# Altium schematic sheet List2.SchDoc
size 209 x 297 mm; SheetNumber: 1; SheetTotal: 1; Scale: 1:1; PageSetup: Record=PageOptions|CenterHorizontal=False|CenterVertical=False|PrintScale=0.95|XCorrection=0.00|YCorrection=0.00|PrintKind=1|BorderSize=5000000|LeftOffset=0|BottomOffset=0|Orientation=1|PaperLength=1000|PaperWidth=1000|Scale=100|PaperSource=15|PrintQuality=600|MediaType=1|DitherType=10|PaperKind=A4|PrintScaleMode=1; Rule: PcbType=ProtelPcb
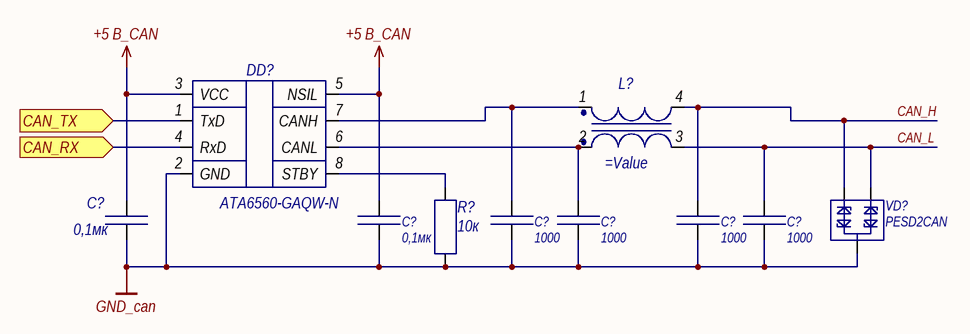
[diagram p0: List2.SchDoc]

## Parts
(Parts that share a designator on the sheet are numbered #1, #2 ... from top to bottom, then left to right.)
C?#1  0,1мк  [CAPC1608N_SL]
C?#2  0,1мк  [CAPC1608N_SL]
C?#3  1000  [CAPC1608N_SL]
C?#4  1000  [CAPC1608N_SL]
C?#5  1000  [CAPC1608N_SL]
C?#6  1000  [CAPC1608N_SL]
DD?  ATA6560-GAQW-N  [SOIC-8N]
L?  (no value)  [DR331]
R?  10к  [RESC1608N_SL]
VD?  PESD2CAN  [SOT23-3N]

## Ports
CAN_RX (in), CAN_TX (in)

## Nets
+5 В_CAN: C?#1.1 C?#2.1 DD?.3(VCC) DD?.5(NSIL)
GND_can: C?#1.2 C?#2.2 C?#3.2 C?#4.2 C?#5.2 C?#6.2 DD?.2(GND) R?.1 VD?.3
CAN_H: C?#5.1 L?.4 VD?.2
CAN_L: C?#6.1 L?.3 VD?.1
CAN_RX: DD?.4(RxD) ; port CAN_RX
CAN_TX: DD?.1(TxD) ; port CAN_TX
NetC?#3_1: C?#3.1 DD?.7(CANH) L?.1
NetC?#4_1: C?#4.1 DD?.6(CANL) L?.2
NetDD?_8: DD?.8(STBY) R?.2

## Notes on the sheet
- Подп. и дата
- Инв. № дубл.
- Взам. инв. №
- Инв. № подл.
- Лист
- Изм.
- № докум.
- Подп.
- Дата
- Копировал
- Фотмат А4

## Library data of the parts
C?#1 = CC0603KRX7R0BB104_Yageo: 0.1µF ±10% 100V Ceramic Capacitor X7R 0603 (1608 Metric); Manufacturer: Yageo; Voltage: 100 В; ValueBOM: Конденсатор CC0603KRX7R0BB104 "Yageo" (0,1 мкФ ± 10 %, 100 В, X7R, SMD 0603); Sorting: 100000; Автор: Ткаченко М.; Количество1: 1; Цена1: 0,21; Количество2: 10; Цена2: 0,14; Разрешен к применению: True; PartNumber: CC0603KRX7R0BB104_Yageo; ManufacturerPartNumber: CC0603KRX7R0BB104; ComponentLink3URL: http://www.yageo.com/documents/recent/UPY-NP0X7R_MV_100-to-630V_18.pdf; ComponentLink3Description: Datasheet; Value: 0,1мк; Tolerance: ± 10 %; TKE: X7R; ComponentLink2Description: Manufacturer Link; ComponentLink2URL: http://www.yageo.com/; Operating Temperature: -55°C ~ +125°C; Modify: 27.02.2017 8:51:43; Supplier: Digi-Key; Supplier P/N: 311-1523-1-ND
C?#2 = CC0603KRX7R9BB104_Yageo: CAP CER 0.1UF 50V 10% X7R 0603; Manufacturer: Yageo; Voltage: 50 В; ValueBOM: Конденсатор CC0603KRX7R9BB104 "Yageo" (0,1 мкФ ± 10 %, 50 В,X7R, SMD 0603); Sorting: 100000; Автор: Хоменко С.П.; Количество1: 10; Цена1: 0,027; Количество2: 100; Цена2: 0,0125; Разрешен к применению: True; PartNumber: CC0603KRX7R9BB104_Yageo; ManufacturerPartNumber: CC0603KRX7R9BB104; ComponentLink3URL: http://www.yageo.com/documents/recent/UPY-GPHC_X7R_6.3V-to-50V-v12.pdf; ComponentLink3Description: Datasheet; Value: 0,1мк; Tolerance: ± 10 %; TKE: X7R; ComponentLink2Description: Manufacturer Link; ComponentLink2URL: http://www.yageo.com/; Operating Temperature: -55°C ~ +125°C; Modify: 06.07.2015; Supplier: Digi-Key; Supplier P/N: 311-1344-1-ND
C?#3-C?#6 = GCM1885C1H102JA16D: CAP CER 1000PF 50V NP0 0603; ValueBOM: Конденсатор GCM1885C1H102JA16D "Murata" (1000 пФ± 10 %, 50 В, C0G, SMD 0603); Value: 1000; Supplier 1: Digi-Key; Supplier Part Number 1: 490-4768-1-ND
DD? = ATA6560-GAQW-N_Microchip Technology: INDUSTRIAL GRADE CAN TRX WITH NS; ValueBOM: Микросхема  ATA6560-GAQW-N "Microchip Technology" SOIC-8; Автор: Ткаченко М.; Количество1: 1; Цена1: 0,55; Количество2: 25; Цена2: 0,45; Разрешен к применению: True; PartNumber: ATA6560-GAQW-N_Microchip Technology; ManufacturerPartNumber: ATA6560-GAQW-N; Manufacturer: Microchip Technology; ComponentLink3URL: http://ww1.microchip.com/downloads/en/DeviceDoc/ATA6560-ATA6561-High-Speed-CAN-Transceiver-DS20005991A.pdf; ComponentLink3Description: Datasheet; Value: ATA6560-GAQW-N; ComponentLink2Description: Manufacturer Link; ComponentLink2URL: http://www.microchip.com/; Operating Temperature: -40°C ~ +85°C; Modify: 15.03.2019 19:43:22; Supplier: Digi-Key; Supplier P/N: ATA6560-GAQW-NCT-ND; Package Description: Leads, Body 4.9x3.9mm, Pitch 1.27mm, IPC Medium Density
L? = DR331-513AE_Bourns Inc.: 51µH @ 100kHz 2 Line Common Mode Choke Surface Mount 500mA DCR 300 mOhm, CAN; ValueBOM: Индуктивность DR331-513AE Bourns Inc.; Marking: 513A; Автор: Хоменко С.П.; Количество1: 10; Цена1: 0,786; Количество2: 250; Цена2: 0,50804; Разрешен к применению: True; PartNumber: DR331-513AE_Bourns Inc.; Manufacturer: Bourns Inc.; ManufacturerPartNumber: DR331-513AE; ComponentLink3URL: http://www.bourns.com/docs/Product-Datasheets/dr331.pdf; ComponentLink3Description: Datasheet; ComponentLink2Description: Manufacturer Link; ComponentLink2URL: http://www.bourns.com; Operating Temperature: -40°C ~ +135°C; Modify: 24.03.2017 10:04:07; Supplier: Digi-Key; Supplier P/N: DR331-513AECT-ND
R? = RC0603JR-0710KL_Yageo: RES SMD 10K OHM 5% 1/10W 0603; Manufacturer: Yageo; Power: 0,1 Вт; ValueBOM: Резистор RC0603JR-0710KL "Yageo" (10 кОм ± 5 %, 0,1 Вт SMD 0603); ТКС: ±100ppm/C°; Marking: 103; Sorting: 10000; Автор: Хоменко С.П.; Количество1: 10; Цена1: 0,011; Количество2: 25; Цена2: 0,008; Разрешен к применению: True; PartNumber: RC0603JR-0710KL_Yageo; ManufacturerPartNumber: RC0603JR-0710KL; ComponentLink3URL: http://www.yageo.com/NewPortal/yageodocoutput?fileName=/pdf/R-Chip/PYu-RC_Group_51_RoHS_L_3.pdf; ComponentLink3Description: Datasheet; Value: 10к; Tolerance: ± 5 %; ComponentLink2Description: Manufacturer Link; ComponentLink2URL: http://www.yageo.com/; Operating Temperature: -55°C ~ +125°C; Modify: 12.08.2015 22:38:32; Supplier: Digi-Key; Supplier P/N: 311-10KGRCT-ND; Package Description: Chip Resistor, Body 1.6x0.8mm, IPC Medium Density
VD? = PESD2CAN,215_NXP Semiconductors: TVS DIODE 24VWM 41VC SOT23 CAN bus protection; ValueBOM: Трансил, сборка PESD2CAN,215 "NXP Semiconductors" SOT23-3; Marking: 6R; Автор: Хоменко С.П.; Количество1: 10; Цена1: 0,406; Количество2: 25; Цена2: 0,333; Разрешен к применению: True; PartNumber: PESD2CAN,215_NXP Semiconductors; ManufacturerPartNumber: PESD2CAN,215; Manufacturer: NXP Semiconductors; ComponentLink3URL: http://www.nxp.com/documents/data_sheet/PESD2CAN.pdf; ComponentLink3Description: Datasheet; Value: PESD2CAN,215; ComponentLink2Description: Manufacturer Link; ComponentLink2URL: http://www.nxp.com/; Operating Temperature: -55°C ~ +150°C; Modify: 12.08.2015 14:44:58; Supplier: Digi-Key; Supplier P/N: 568-4147-1-ND; Package Description: SOT23, 3-Leads, Body 2.9x1.3mm, Pitch 0.95mm, Lead Span 2.5mm, IPC Medium Density